# Altium schematic sheet NuPrism_MCPMT - QUAD ADC - Rev2.SchDoc: NuPrism Multichannel PMT - QUAD ADC
size A; DrawnBy: D.Bishop; DocumentNumber: 10; Revision: 2; SheetNumber: 10; SheetTotal: 20
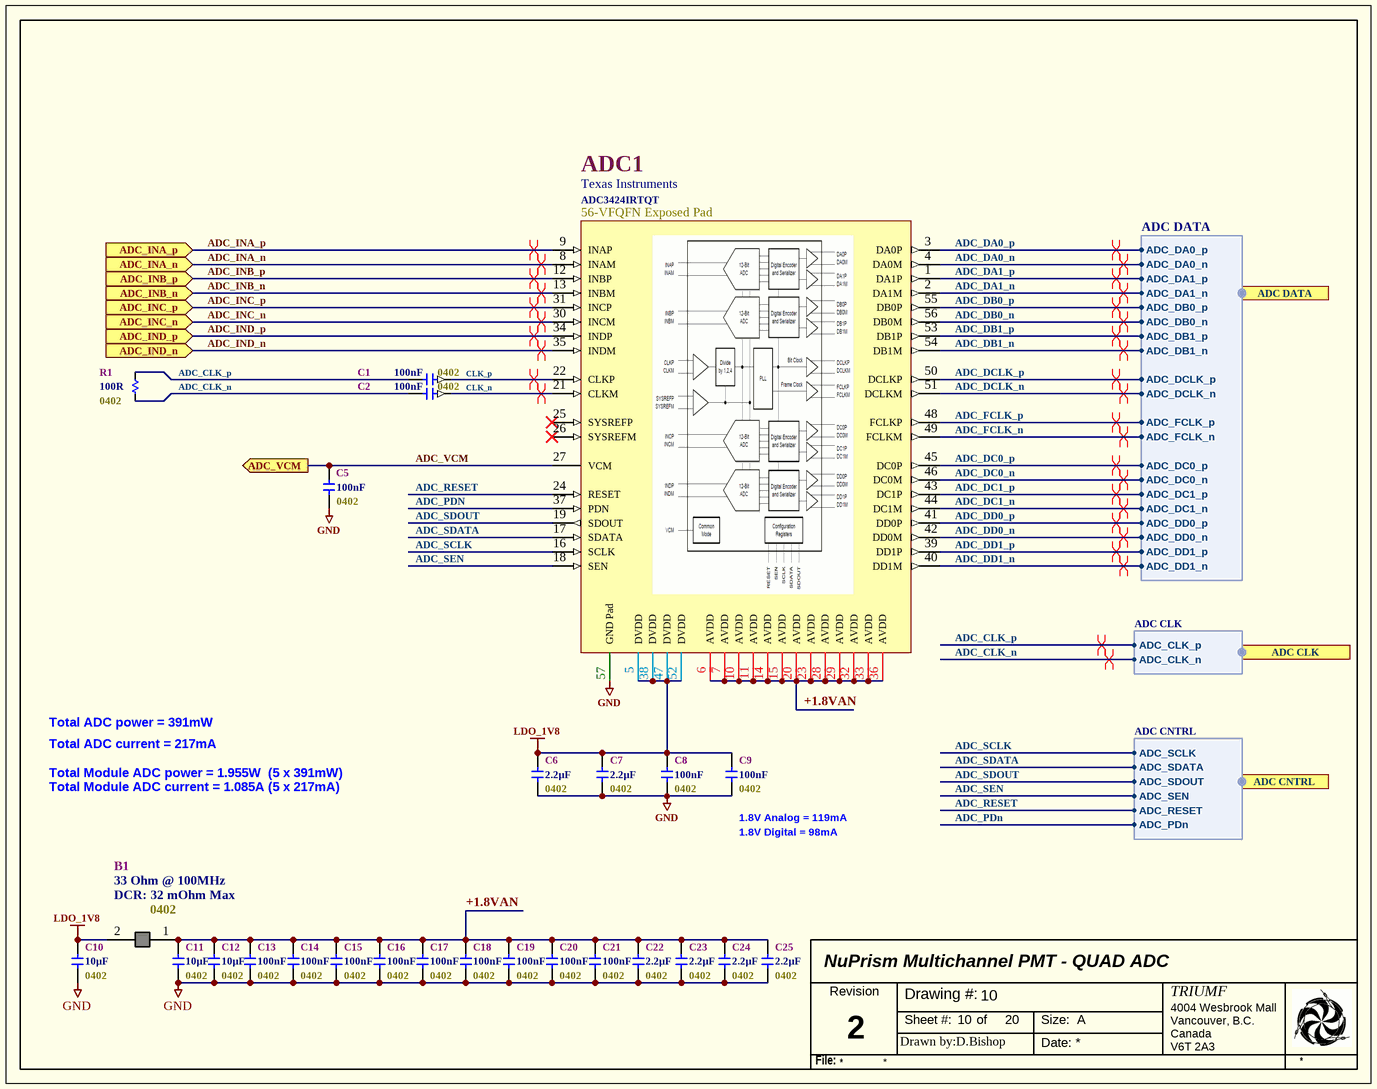
[diagram p0: NuPrism_MCPMT - QUAD ADC - Rev2.SchDoc]

## Parts
ADC1  Manufacturer: Texas Instruments  Package: 56-VFQFN Exposed Pad  [VQFN56]  (hidden comment: ADC3424IRTQT)
B1  DCR: 32 mOhm Max  Impedance @ Frequency: 33 Ohm @ 100MHz  [0402]  (hidden comment: BLM15PX600SN1D)
C1  Capacitance: 100nF  [0402]  (hidden comment: C0402C104K4RACTU)
C2  Capacitance: 100nF  [0402]  (hidden comment: C0402C104K4RACTU)
C5  Capacitance: 100nF  [0402]  (hidden comment: C0402C104K4RACTU)
C6  Capacitance: 2.2µF  [0402]  (hidden comment: TMK105CBJ225KV-F)
C7  Capacitance: 2.2µF  [0402]  (hidden comment: TMK105CBJ225KV-F)
C8  Capacitance: 100nF  [0402]  (hidden comment: C0402C104K4RACTU)
C9  Capacitance: 100nF  [0402]  (hidden comment: C0402C104K4RACTU)
C10  Capacitance: 10µF  [0402]  (hidden comment: CL05A106MQ5NRNC)
C11  Capacitance: 10µF  [0402]  (hidden comment: CL05A106MQ5NRNC)
C12  Capacitance: 10µF  [0402]  (hidden comment: CL05A106MQ5NRNC)
C13  Capacitance: 100nF  [0402]  (hidden comment: C0402C104K4RACTU)
C14  Capacitance: 100nF  [0402]  (hidden comment: C0402C104K4RACTU)
C15  Capacitance: 100nF  [0402]  (hidden comment: C0402C104K4RACTU)
C16  Capacitance: 100nF  [0402]  (hidden comment: C0402C104K4RACTU)
C17  Capacitance: 100nF  [0402]  (hidden comment: C0402C104K4RACTU)
C18  Capacitance: 100nF  [0402]  (hidden comment: C0402C104K4RACTU)
C19  Capacitance: 100nF  [0402]  (hidden comment: C0402C104K4RACTU)
C20  Capacitance: 100nF  [0402]  (hidden comment: C0402C104K4RACTU)
C21  Capacitance: 100nF  [0402]  (hidden comment: C0402C104K4RACTU)
C22  Capacitance: 2.2µF  [0402]  (hidden comment: TMK105CBJ225KV-F)
C23  Capacitance: 2.2µF  [0402]  (hidden comment: TMK105CBJ225KV-F)
C24  Capacitance: 2.2µF  [0402]  (hidden comment: TMK105CBJ225KV-F)
C25  Capacitance: 2.2µF  [0402]  (hidden comment: TMK105CBJ225KV-F)
R1  Resistance: 100R  [0402]  (hidden comment: RMCF0402FT100R)

## Ports
ADC CLK (harness ADC CLK), ADC CNTRL (harness ADC CNTRL), ADC DATA (harness ADC DATA), ADC_INA_n (in), ADC_INA_p (in), ADC_INB_n (in), ADC_INB_p (in), ADC_INC_n (in), ADC_INC_p (in), ADC_IND_n (in), ADC_IND_p (in), ADC_VCM (out)

## Harnesses
ADC DATA: ADC_DD0_p, ADC_DD0_n, ADC_DA0_p, ADC_DA0_n, ADC_DA1_p, ADC_DA1_n, ADC_DD1_p, ADC_DD1_n, ADC_DB0_p, ADC_DB0_n, ADC_DB1_p, ADC_DB1_n, ADC_DC0_p, ADC_DC0_n, ADC_DC1_p, ADC_DC1_n, ADC_DCLK_p, ADC_DCLK_n, ADC_FCLK_p, ADC_FCLK_n
ADC CLK: ADC_CLK_n, ADC_CLK_p
ADC CNTRL: ADC_SEN, ADC_SCLK, ADC_SDATA, ADC_SDOUT, ADC_RESET, ADC_PDn

## Nets
GND: ADC1.57(GND_Pad) C5.2 C6.2 C7.2 C8.2 C9.2 C10.1 C11.1 C12.1 C13.2 C14.2 C15.2 C16.2 C17.2 C18.2 C19.2 C20.2 C21.2 C22.2 C23.2 C24.2 C25.2
LDO_1V8: ADC1.5(DVDD) ADC1.38(DVDD) ADC1.47(DVDD) ADC1.52(DVDD) B1.2 C6.1 C7.1 C8.1 C9.1 C10.2
+1.8VAN: ADC1.6(AVDD) ADC1.7(AVDD) ADC1.10(AVDD) ADC1.11(AVDD) ADC1.14(AVDD) ADC1.15(AVDD) ADC1.20(AVDD) ADC1.23(AVDD) ADC1.28(AVDD) ADC1.29(AVDD) ADC1.32(AVDD) ADC1.33(AVDD) ADC1.36(AVDD) B1.1 C11.2 C12.2 C13.1 C14.1 C15.1 C16.1 C17.1 C18.1 C19.1 C20.1 C21.1 C22.1 C23.1 C24.1 C25.1
ADC_CLK_n: C2.2 R1.2 ; port ADC CLK.ADC_CLK_n
ADC_CLK_p: C1.2 R1.1 ; port ADC CLK.ADC_CLK_p
ADC_DA0_n: ADC1.4(DA0M) ; port ADC DATA.ADC_DA0_n
ADC_DA0_p: ADC1.3(DA0P) ; port ADC DATA.ADC_DA0_p
ADC_DA1_n: ADC1.2(DA1M) ; port ADC DATA.ADC_DA1_n
ADC_DA1_p: ADC1.1(DA1P) ; port ADC DATA.ADC_DA1_p
ADC_DB0_n: ADC1.56(DB0M) ; port ADC DATA.ADC_DB0_n
ADC_DB0_p: ADC1.55(DB0P) ; port ADC DATA.ADC_DB0_p
ADC_DB1_n: ADC1.54(DB1M) ; port ADC DATA.ADC_DB1_n
ADC_DB1_p: ADC1.53(DB1P) ; port ADC DATA.ADC_DB1_p
ADC_DC0_n: ADC1.46(DC0M) ; port ADC DATA.ADC_DC0_n
ADC_DC0_p: ADC1.45(DC0P) ; port ADC DATA.ADC_DC0_p
ADC_DC1_n: ADC1.44(DC1M) ; port ADC DATA.ADC_DC1_n
ADC_DC1_p: ADC1.43(DC1P) ; port ADC DATA.ADC_DC1_p
ADC_DCLK_n: ADC1.51(DCLKM) ; port ADC DATA.ADC_DCLK_n
ADC_DCLK_p: ADC1.50(DCLKP) ; port ADC DATA.ADC_DCLK_p
ADC_DD0_n: ADC1.42(DD0M) ; port ADC DATA.ADC_DD0_n
ADC_DD0_p: ADC1.41(DD0P) ; port ADC DATA.ADC_DD0_p
ADC_DD1_n: ADC1.40(DD1M) ; port ADC DATA.ADC_DD1_n
ADC_DD1_p: ADC1.39(DD1P) ; port ADC DATA.ADC_DD1_p
ADC_FCLK_n: ADC1.49(FCLKM) ; port ADC DATA.ADC_FCLK_n
ADC_FCLK_p: ADC1.48(FCLKP) ; port ADC DATA.ADC_FCLK_p
ADC_INA_n: ADC1.8(INAM) ; port ADC_INA_n
ADC_INA_p: ADC1.9(INAP) ; port ADC_INA_p
ADC_INB_n: ADC1.13(INBM) ; port ADC_INB_n
ADC_INB_p: ADC1.12(INBP) ; port ADC_INB_p
ADC_INC_n: ADC1.30(INCM) ; port ADC_INC_n
ADC_INC_p: ADC1.31(INCP) ; port ADC_INC_p
ADC_IND_n: ADC1.35(INDM) ; port ADC_IND_n
ADC_IND_p: ADC1.34(INDP) ; port ADC_IND_p
ADC_PDN: ADC1.37(PDN) ; port ADC CNTRL.ADC_PDn
ADC_RESET: ADC1.24(RESET) ; port ADC CNTRL.ADC_RESET
ADC_SCLK: ADC1.16(SCLK) ; port ADC CNTRL.ADC_SCLK
ADC_SDATA: ADC1.17(SDATA) ; port ADC CNTRL.ADC_SDATA
ADC_SDOUT: ADC1.19(SDOUT) ; port ADC CNTRL.ADC_SDOUT
ADC_SEN: ADC1.18(SEN) ; port ADC CNTRL.ADC_SEN
ADC_VCM: ADC1.27(VCM) C5.1 ; port ADC_VCM
CLK_n: ADC1.21(CLKM) C2.1
CLK_p: ADC1.22(CLKP) C1.1

Not connected (* = marked no-connect by the designer): ADC1 25(SYSREFP)* 26(SYSREFM)*

## Layout directives
differential pair: ADC_CLK_n, ADC_CLK_p, ADC_DA0_n, ADC_DA0_p, ADC_DA1_n, ADC_DA1_p, ADC_DB0_n, ADC_DB0_p, ADC_DB1_n, ADC_DB1_p, ADC_DC0_n, ADC_DC0_p, ADC_DC1_n, ADC_DC1_p, ADC_DCLK_n, ADC_DCLK_p, ADC_DD0_n, ADC_DD0_p, ADC_DD1_n, ADC_DD1_p, ADC_FCLK_n, ADC_FCLK_p, ADC_INA_n, ADC_INA_p, ADC_INB_n, ADC_INB_p, ADC_INC_n, ADC_INC_p, ADC_IND_n, ADC_IND_p, CLK_n, CLK_p

## Notes on the sheet
- Total ADC power = 391mW
- Total ADC current = 217mA
- Total Module ADC power = 1.955W  (5 x 391mW)
- Total Module ADC current = 1.085A (5 x 217mA)
- (near C9) 1.8V Analog = 119mA
- (near C9) 1.8V Digital = 98mA
- Revision
- Sheet #:
- Drawing #:
- of
- Size:
- A
- TRIUMF
- 4004 Wesbrook Mall
- Vancouver, B.C.
- Canada
- File:
- Drawn by:
- Date:
- V6T 2A3

## Library data of the parts
ADC1 = ADC3424: 12 Bit Analog to Digital Converter 4 Input 4 Pipelined 56-QFN (8x8); PartNo: ADC3424IRTQT; Family: Semiconductor
B1 = Ferrite Bead: 60 Ohms @ 100MHz Ferrite Bead 0402 2.5A; Manufacturer: Murata; Package: 0402; PartNo: BLM15PX600SN1D; Family: Bead; Case Code (Imperial): 0402; Case Code (Metric): 1005
C1 C2 C5 C8 C9 C13-C21 = CAP-SMALL: SMD/SMT 0402 16V 0.1uF X7R 10%; Manufacturer: Kemet; SN_CATEGORY: Capacitor; Package: 0402; Voltage: 16V; PartNo: C0402C104K4RACTU; Case Code (Imperial): 0402; Family: Capacitor; Case Code (Metric): 1005; SN_ACT_CAP_TMPRT: ?; SN_CAP_TMPRT_CLC_MTHD: ?; SN_INRMTT_OPRT_RTIO: ?; SN_OPRT_VLTG: ?; SN_TMPRT_RISE_SLF_HTNG: ?; SN_CAP_TYP: ?; SN_QUAL_GRD: ?; SN_RTD_VLTG: ?
C6 C7 C22-C25 = CAP-SMALL: SMD/SMT 0402 25V 2.2uF 10% X5R; Manufacturer: Taiyo Yuden; SN_CATEGORY: Capacitor; Package: 0402; Voltage: 25V; PartNo: TMK105CBJ225KV-F; Family: Capacitor; Case Code (Imperial): 0402; Case Code (Metric): 1005; SN_ACT_CAP_TMPRT: ?; SN_CAP_TMPRT_CLC_MTHD: ?; SN_INRMTT_OPRT_RTIO: ?; SN_OPRT_VLTG: ?; SN_TMPRT_RISE_SLF_HTNG: ?; SN_CAP_TYP: ?; SN_QUAL_GRD: ?; SN_RTD_VLTG: ?
C10-C12 = ECJ2FB1A106K: 10 µF ±20% 6.3V Ceramic Capacitor X5R 0402 (1005 Metric); Manufacturer: Samsung Electro-Mechanics; Package: 0402; Voltage: 6.3V; PartNo: CL05A106MQ5NRNC; Family: Capacitor; Case Code (Imperial): 0402; Case Code (Metric): 1005; SN_CATEGORY: Capacitor; SN_ACT_CAP_TMPRT: ?; SN_CAP_TMPRT_CLC_MTHD: ?; SN_INRMTT_OPRT_RTIO: ?; SN_OPRT_VLTG: ?; SN_TMPRT_RISE_SLF_HTNG: ?; SN_CAP_TYP: ?; SN_QUAL_GRD: ?; SN_RTD_VLTG: ?
R1 = RES-TINY: 100 Ohms ±1% 0.063W, 1/16W Chip Resistor 0402 (1005 Metric); Manufacturer: Stackpole Electronics Inc; Package: 0402; PartNo: RMCF0402FT100R; Family: Resistor; Case Code (Imperial): 0402; Case Code (Metric): 1005; SN_CATEGORY: Resistor; SN_ACT_SRFC_TMPRT: ?; SN_INRMTT_OPRT_RTIO: ?; SN_OPRT_PWR_DSSP: ?; SN_RES_TMPRT_CLC_MTHD: ?; SN_MAX_TMPRT: ?; SN_RTD_PWR_DSSP: ?; SN_RES_TYP: ?